# Altium project UltraZOhm_CarrierBoard.PrjPcb (part 4 of 8)

## Sheet Board2Board.SchDoc
size A4; Author: A. Geiger & E. Liegmann; CompanyName: Technische Hochschule Nürnberg Georg Simon Ohm; Organization: UltraZohm; Address1: Kesslerplatz 12; Address2: 90489 Nürnberg; Address3: GERMANY; SheetNumber: 2; SheetTotal: 36; Website: www.ultrazohm.com
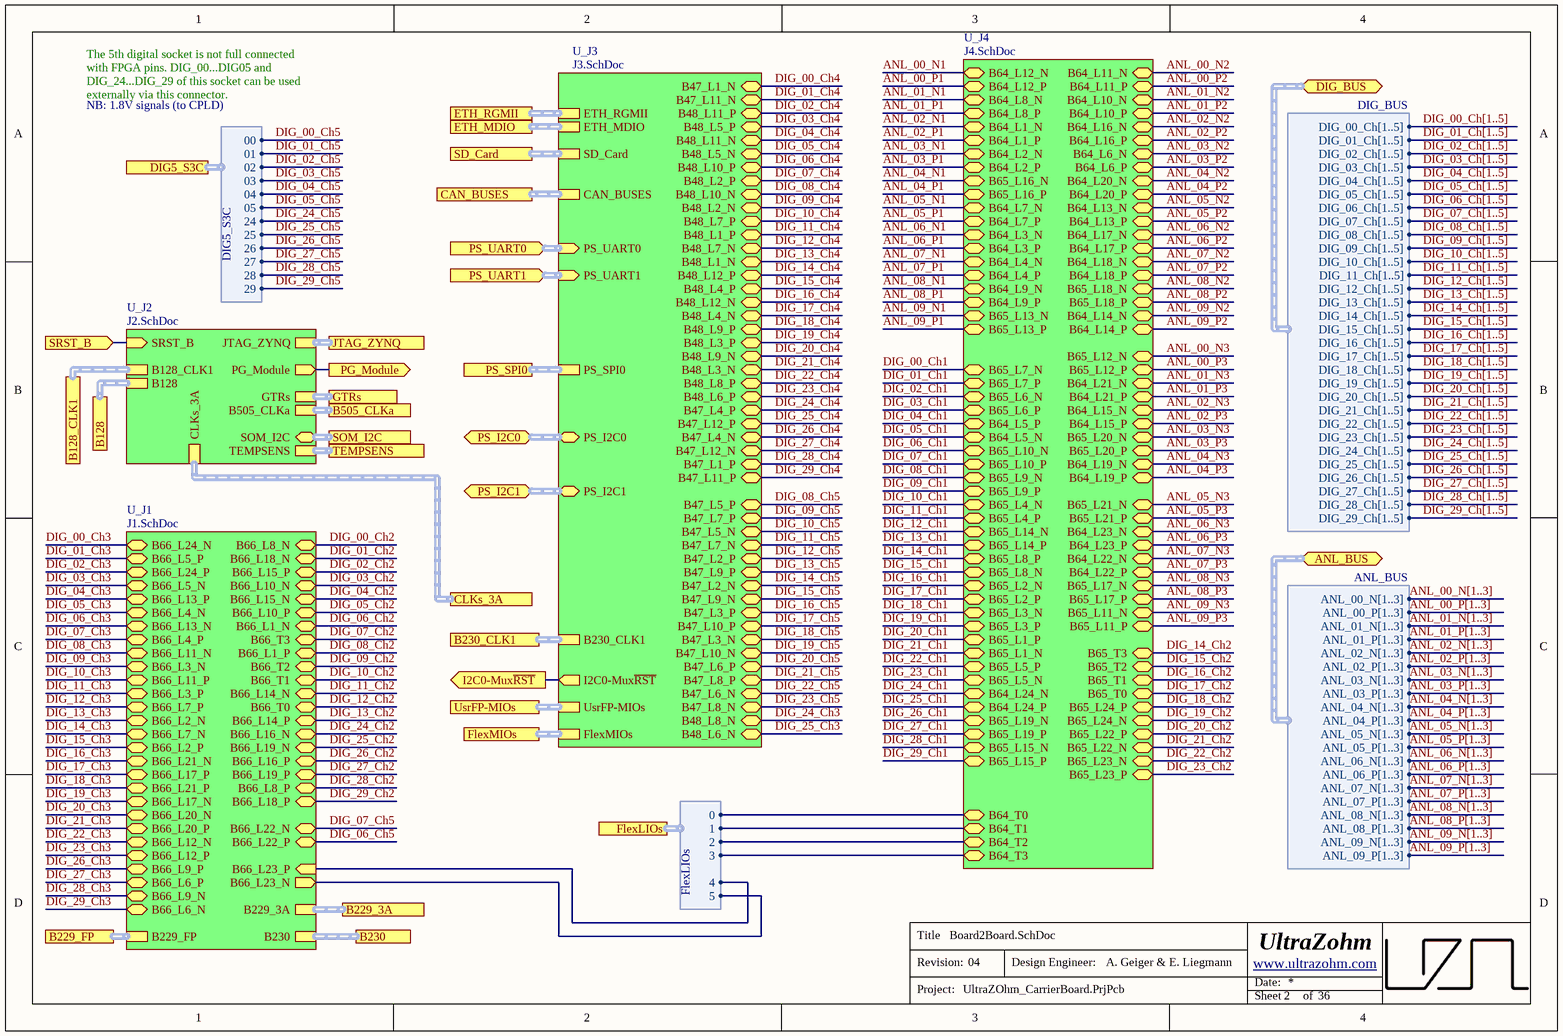
[diagram p11: Board2Board.SchDoc]

### Sub-sheets
U_J1 = J1.SchDoc: B66_L1_P (bidir), B66_L1_N (bidir), B66_L5_P (bidir), B66_L5_N (bidir), B66_L6_P (bidir), B66_L6_N (bidir), B66_L4_N (bidir), B66_L4_P (bidir), B66_L2_N (bidir), B66_L24_N (bidir), B66_L9_N (bidir), B66_L8_N (bidir), B66_L23_N (out), B66_L20_N (bidir), B66_L12_N (bidir), B66_L24_P (bidir), B66_L8_P (bidir), B66_L18_N (bidir), B66_L21_N (bidir), B66_L7_P (bidir), B66_L19_P (bidir), B66_L11_N (bidir), B66_L20_P (bidir), B66_L21_P (bidir), B66_L9_P (bidir), B66_L10_P (bidir), B66_L22_P (bidir), B66_L16_N (bidir), B66_L3_P (bidir), B66_L17_N (bidir), B66_L15_P (bidir), B66_L16_P (bidir), B66_L19_N (bidir), B66_L14_N (bidir), B66_L17_P (bidir), B66_L7_N (bidir), B66_L3_N (bidir), B66_L10_N (bidir), B66_L15_N (bidir), B66_L22_N (bidir), B66_L14_P (bidir), B66_L11_P (bidir), B66_L2_P (bidir), B66_L13_P (bidir), B66_L23_P (in), B66_L18_P (bidir), B66_L12_P (bidir), B66_L13_N (bidir), B66_T1 (bidir), B66_T2 (bidir), B66_T0 (bidir), B66_T3 (bidir), B229_3A (harness MGT3), B230 (harness MGT4), B229_FP (harness GTH)
U_J2 = J2.SchDoc: SRST_B (in), PG_Module (out), SOM_I2C (bidir, harness I2C), GTRs (harness GTRs), JTAG_ZYNQ (harness JTAG), TEMPSENS (harness T_DIODE), B505_CLKa (harness MGTCLK), CLKs_3A (harness CLKs_3A), B128 (harness MGT4), B128_CLK1 (harness MGTCLK)
U_J3 = J3.SchDoc: B48_L9_P (bidir), B47_L6_P (bidir), B48_L2_P (bidir), B48_L8_N (bidir), B48_L1_P (bidir), B47_L8_N (bidir), B47_L10_P (bidir), B47_L12_P (bidir), B47_L8_P (bidir), B47_L9_P (bidir), B48_L12_P (bidir), B48_L2_N (bidir), B47_L4_P (bidir), B47_L2_P (bidir), B47_L10_N (bidir), B48_L12_N (bidir), B47_L2_N (bidir), B47_L3_N (bidir), B48_L6_N (bidir), B48_L3_P (bidir), B47_L3_P (bidir), B47_L7_N (bidir), B48_L11_N (bidir), B48_L4_P (bidir), B47_L5_P (bidir), B47_L1_N (bidir), B47_L1_P (bidir), B47_L6_N (bidir), B48_L5_P (bidir), B48_L10_P (bidir), B47_L5_N (bidir), B48_L3_N (bidir), B47_L7_P (bidir), B48_L1_N (bidir), B48_L5_N (bidir), B47_L12_N (bidir), B48_L9_N (bidir), B48_L11_P (bidir), B47_L9_N (bidir), B48_L4_N (bidir), B47_L4_N (bidir), B48_L6_P (bidir), B47_L11_P (bidir), B48_L8_P (bidir), B48_L10_N (bidir), B47_L11_N (bidir), B48_L7_P (bidir), B48_L7_N (bidir), PS_UART0 (in, harness UART), PS_UART1 (in, harness UART), PS_I2C1 (bidir, harness I2C), PS_I2C0 (bidir, harness I2C), ETH_RGMII (harness ETH_RGMII), SD_Card (harness SD_Card), ETH_MDIO (harness ETH_MDIO), PS_SPI0 (harness SPI), CAN_BUSES (harness CAN_BUSES), UsrFP-MIOs (harness UsrFP-MIOs), FlexMIOs (harness FlexMIOs), I2C0-Mux~{RST} (out), B230_CLK1 (harness MGTCLK)
U_J4 = J4.SchDoc: B65_L1_N (bidir), B65_L1_P (bidir), B64_L9_N (bidir), B64_L5_P (bidir), B64_L9_P (bidir), B64_L4_P (bidir), B64_L7_N (bidir), B64_L2_N (bidir), B64_L4_N (bidir), B64_L12_N (bidir), B64_L1_P (bidir), B64_L12_P (bidir), B64_L10_N (bidir), B64_L8_N (bidir), B64_L6_P (bidir), B64_L7_P (bidir), B64_L5_N (bidir), B64_L3_P (bidir), B64_L6_N (bidir), B64_L3_N (bidir), B64_L1_N (bidir), B64_L2_P (bidir), B64_L11_N (bidir), B64_L10_P (bidir), B64_L8_P (bidir), B64_L11_P (bidir), B64_L21_P (bidir), B64_L19_P (bidir), B64_L16_N (bidir), B64_L13_P (bidir), B64_L14_P (bidir), B64_L17_N (bidir), B64_L18_N (bidir), B64_L16_P (bidir), B64_L20_P (bidir), B64_L24_P (bidir), B64_L15_P (bidir), B64_L13_N (bidir), B64_L14_N (bidir), B64_L23_P (bidir), B64_L24_N (bidir), B64_L15_N (bidir), B64_L19_N (bidir), B64_L17_P (bidir), B64_L22_P (bidir), B64_L20_N (bidir), B64_L22_N (bidir), B64_L23_N (bidir), B64_L18_P (bidir), B64_L21_N (bidir), B65_L5_P (bidir), B65_L9_P (bidir), B65_L10_P (bidir), B65_L8_P (bidir), B65_L10_N (bidir), B65_L2_N (bidir), B65_L11_P (bidir), B65_L6_N (bidir), B65_L11_N (bidir), B65_L4_P (bidir), B65_L8_N (bidir), B65_L5_N (bidir), B65_L7_N (bidir), B65_L7_P (bidir), B65_L12_P (bidir), B65_L3_P (bidir), B65_L12_N (bidir), B65_L3_N (bidir), B65_L4_N (bidir), B65_L2_P (bidir), B65_L6_P (bidir), B65_L9_N (bidir), B65_L16_P (bidir), B65_L23_N (bidir), B65_L13_N (bidir), B65_L13_P (bidir), B65_L16_N (bidir), B65_L24_P (bidir), B65_L21_P (bidir), B65_L15_N (bidir), B65_L17_N (bidir), B65_L18_P (bidir), B65_L20_N (bidir), B65_L19_P (bidir), B65_L21_N (bidir), B65_L15_P (bidir), B65_L22_N (bidir), B65_L23_P (bidir), B65_L17_P (bidir), B65_L22_P (bidir), B65_L24_N (bidir), B65_L19_N (bidir), B65_L18_N (bidir), B65_L20_P (bidir), B65_T1 (bidir), B65_T2 (bidir), B65_T3 (bidir), B65_T0 (bidir), B65_L14_N (bidir), B65_L14_P (bidir), B64_T0 (bidir), B64_T1 (bidir), B64_T2 (bidir), B64_T3 (bidir)

### Ports
ANL_BUS (bidir, harness ANL_BUS), B128 (harness MGT4), B128_CLK1 (harness MGTCLK), B229_3A (harness MGT3), B229_FP (harness GTH), B230 (harness MGT4), B230_CLK1 (harness MGTCLK), B505_CLKa (harness MGTCLK), CAN_BUSES (harness CAN_BUSES), CLKs_3A (harness CLKs_3A), DIG5_S3C (harness DIG5_S3C), DIG_BUS (bidir, harness DIG_BUS), ETH_MDIO (harness ETH_MDIO), ETH_RGMII (harness ETH_RGMII), FlexLIOs (harness FlexLIOs), FlexMIOs (harness FlexMIOs), GTRs (harness GTRs), I2C0-Mux~{RST} (out), JTAG_ZYNQ (harness JTAG), PG_Module (out), PS_I2C0 (bidir, harness I2C), PS_I2C1 (bidir, harness I2C), PS_SPI0 (harness SPI), PS_UART0 (in, harness UART), PS_UART1 (in, harness UART), SD_Card (harness SD_Card), SOM_I2C (harness I2C), SRST_B (in), TEMPSENS (harness T_DIODE), UsrFP-MIOs (harness UsrFP-MIOs)

### Harnesses
DIG_BUS: DIG_01_Ch[1..5], DIG_02_Ch[1..5], DIG_03_Ch[1..5], DIG_04_Ch[1..5], DIG_05_Ch[1..5], DIG_06_Ch[1..5], DIG_07_Ch[1..5], DIG_08_Ch[1..5], DIG_09_Ch[1..5], DIG_10_Ch[1..5], DIG_11_Ch[1..5], DIG_12_Ch[1..5], DIG_13_Ch[1..5], DIG_14_Ch[1..5], DIG_15_Ch[1..5], DIG_16_Ch[1..5], DIG_17_Ch[1..5], DIG_18_Ch[1..5], DIG_19_Ch[1..5], DIG_20_Ch[1..5], DIG_21_Ch[1..5], DIG_22_Ch[1..5], DIG_23_Ch[1..5], DIG_24_Ch[1..5], DIG_25_Ch[1..5], DIG_26_Ch[1..5], DIG_27_Ch[1..5], DIG_28_Ch[1..5], DIG_29_Ch[1..5], DIG_00_Ch[1..5]
ANL_BUS: ANL_00_N[1..3], ANL_00_P[1..3], ANL_01_N[1..3], ANL_01_P[1..3], ANL_02_N[1..3], ANL_02_P[1..3], ANL_03_N[1..3], ANL_03_P[1..3], ANL_04_N[1..3], ANL_04_P[1..3], ANL_05_N[1..3], ANL_05_P[1..3], ANL_06_N[1..3], ANL_06_P[1..3], ANL_07_N[1..3], ANL_07_P[1..3], ANL_08_N[1..3], ANL_08_P[1..3], ANL_09_N[1..3], ANL_09_P[1..3]
DIG5_S3C: 00, 01, 02, 03, 04, 05, 24, 25, 26, 27, 28, 29
FlexLIOs: 0, 1, 2, 3, 4, 5

### Nets
B66_L23_N: sheet U_J1/B66_L23_N, port FlexLIOs.5
B66_L23_P: sheet U_J1/B66_L23_P, port FlexLIOs.4
DIG_00_Ch5: port DIG5_S3C.00
DIG_01_Ch5: port DIG5_S3C.01
DIG_02_Ch5: port DIG5_S3C.02
DIG_03_Ch5: port DIG5_S3C.03
DIG_04_Ch5: port DIG5_S3C.04
DIG_05_Ch5: port DIG5_S3C.05
DIG_24_Ch5: port DIG5_S3C.24
DIG_25_Ch5: port DIG5_S3C.25
DIG_26_Ch5: port DIG5_S3C.26
DIG_27_Ch5: port DIG5_S3C.27
DIG_28_Ch5: port DIG5_S3C.28
DIG_29_Ch5: port DIG5_S3C.29
I2C0-Mux~{RST}: port I2C0-Mux~{RST}, sheet U_J3/I2C0-Mux~{RST}
PG_PL: port PG_Module, sheet U_J2/PG_Module
SRST_B: port SRST_B, sheet U_J2/SRST_B
(unnamed): sheet U_J4/B64_T0, port FlexLIOs.0
(unnamed): sheet U_J4/B64_T1, port FlexLIOs.1
(unnamed): sheet U_J4/B64_T2, port FlexLIOs.2
(unnamed): sheet U_J4/B64_T3, port FlexLIOs.3

### Buses and harness runs
bus ANL_00_N[1..3]
bus ANL_00_P[1..3]
bus ANL_01_N[1..3]
bus ANL_01_P[1..3]
bus ANL_02_N[1..3]
bus ANL_02_P[1..3]
bus ANL_03_N[1..3]
bus ANL_03_P[1..3]
bus ANL_04_N[1..3]
bus ANL_04_P[1..3]
bus ANL_05_N[1..3]
bus ANL_05_P[1..3]
bus ANL_06_N[1..3]
bus ANL_06_P[1..3]
bus ANL_07_N[1..3]
bus ANL_07_P[1..3]
bus ANL_08_N[1..3]
bus ANL_08_P[1..3]
bus ANL_09_N[1..3]
bus ANL_09_P[1..3]
bus DIG_00_Ch[1..5]
bus DIG_01_Ch[1..5]
bus DIG_02_Ch[1..5]
bus DIG_03_Ch[1..5]
bus DIG_04_Ch[1..5]
bus DIG_05_Ch[1..5]
bus DIG_06_Ch[1..5]
bus DIG_07_Ch[1..5]
bus DIG_08_Ch[1..5]
bus DIG_09_Ch[1..5]
bus DIG_10_Ch[1..5]
bus DIG_11_Ch[1..5]
bus DIG_12_Ch[1..5]
bus DIG_13_Ch[1..5]
bus DIG_14_Ch[1..5]
bus DIG_15_Ch[1..5]
bus DIG_16_Ch[1..5]
bus DIG_17_Ch[1..5]
bus DIG_18_Ch[1..5]
bus DIG_19_Ch[1..5]
bus DIG_20_Ch[1..5]
bus DIG_21_Ch[1..5]
bus DIG_22_Ch[1..5]
bus DIG_23_Ch[1..5]
bus DIG_24_Ch[1..5]
bus DIG_25_Ch[1..5]
bus DIG_26_Ch[1..5]
bus DIG_27_Ch[1..5]
bus DIG_28_Ch[1..5]
bus DIG_29_Ch[1..5]
harness port B128 = sheet U_J2/B128
harness port B128_CLK1 = sheet U_J2/B128_CLK1
harness port B229_3A = sheet U_J1/B229_3A
harness port B229_FP = sheet U_J1/B229_FP
harness port B230 = sheet U_J1/B230
harness port B230_CLK1 = sheet U_J3/B230_CLK1
harness port B505_CLKa = sheet U_J2/B505_CLKa
harness port CAN_BUSES = sheet U_J3/CAN_BUSES
harness port CLKs_3A = sheet U_J2/CLKs_3A
harness port ETH_MDIO = sheet U_J3/ETH_MDIO
harness port ETH_RGMII = sheet U_J3/ETH_RGMII
harness port FlexMIOs = sheet U_J3/FlexMIOs
harness port GTRs = sheet U_J2/GTRs
harness port JTAG_ZYNQ = sheet U_J2/JTAG_ZYNQ
harness port PS_I2C0 = sheet U_J3/PS_I2C0
harness port PS_I2C1 = sheet U_J3/PS_I2C1
harness port PS_SPI0 = sheet U_J3/PS_SPI0
harness port PS_UART0 = sheet U_J3/PS_UART0
harness port PS_UART1 = sheet U_J3/PS_UART1
harness port SD_Card = sheet U_J3/SD_Card
harness port SOM_I2C = sheet U_J2/SOM_I2C
harness port TEMPSENS = sheet U_J2/TEMPSENS
harness port UsrFP-MIOs = sheet U_J3/UsrFP-MIOs

### Notes on the sheet
- The 5th digital socket is not full connected with FPGA pins. DIG_00...DIG05 and DIG_24...DIG_29 of this socket can be used externally via this connector.
- NB: 1.8V signals (to CPLD)
- Title
- Revision:
- Design Engineer:
- Date:
- Project:
- Sheet
- of

## Sheet J1.SchDoc
size A4; Author: A. Geiger & E. Liegmann; CompanyName: Technische Hochschule Nürnberg Georg Simon Ohm; Organization: UltraZohm; Address1: Kesslerplatz 12; Address2: 90489 Nürnberg; Address3: GERMANY; SheetNumber: 3; SheetTotal: 36; Website: www.ultrazohm.com
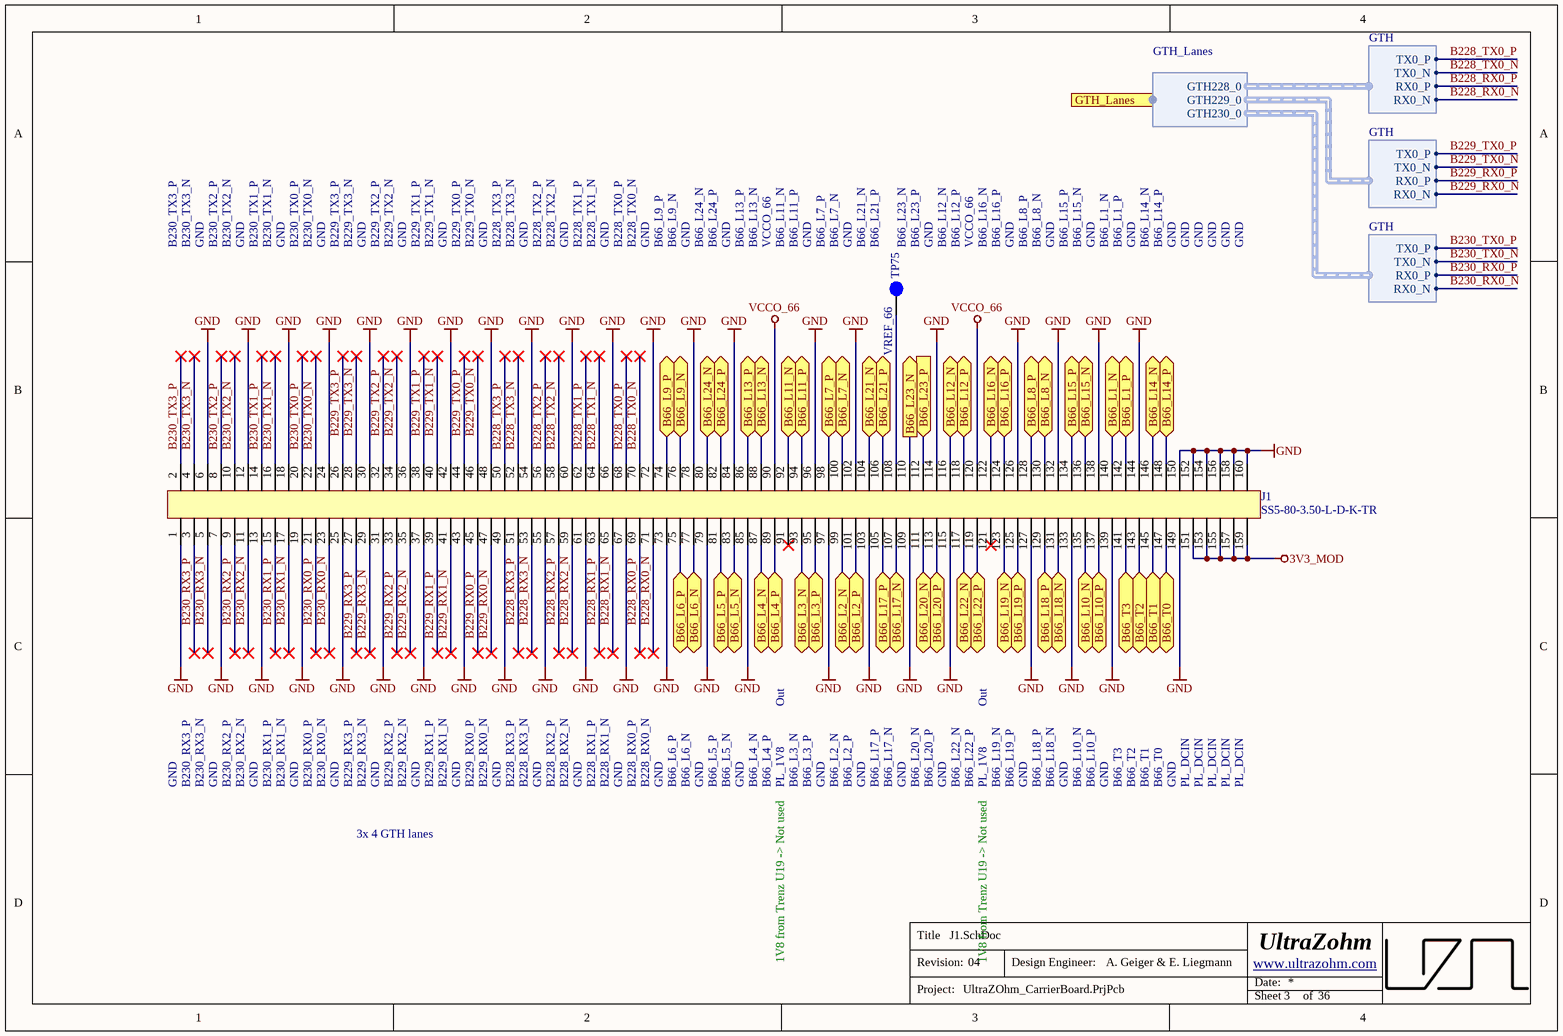
[diagram p12: J1.SchDoc]

### Parts
J1  SS5-80-3.50-L-D-K-TR  [SS5-80-3.50-L-D-K-TR]
TP75  Testpoint 1mm  [TP_1mm]  (value not drawn)  (no BOM)

### Ports
B66_L1_N (bidir), B66_L1_P (bidir), B66_L2_N (bidir), B66_L2_P (bidir), B66_L3_N (bidir), B66_L3_P (bidir), B66_L4_N (bidir), B66_L4_P (bidir), B66_L5_N (bidir), B66_L5_P (bidir), B66_L6_N (bidir), B66_L6_P (bidir), B66_L7_N (bidir), B66_L7_P (bidir), B66_L8_N (bidir), B66_L8_P (bidir), B66_L9_N (bidir), B66_L9_P (bidir), B66_L10_N (bidir), B66_L10_P (bidir), B66_L11_N (bidir), B66_L11_P (bidir), B66_L12_N (bidir), B66_L12_P (bidir), B66_L13_N (bidir), B66_L13_P (bidir), B66_L14_N (bidir), B66_L14_P (bidir), B66_L15_N (bidir), B66_L15_P (bidir), B66_L16_N (bidir), B66_L16_P (bidir), B66_L17_N (bidir), B66_L17_P (bidir), B66_L18_N (bidir), B66_L18_P (bidir), B66_L19_N (bidir), B66_L19_P (bidir), B66_L20_N (bidir), B66_L20_P (bidir), B66_L21_N (bidir), B66_L21_P (bidir), B66_L22_N (bidir), B66_L22_P (bidir), B66_L23_N (out), B66_L23_P (in), B66_L24_N (bidir), B66_L24_P (bidir), B66_T0 (bidir), B66_T1 (bidir), B66_T2 (bidir), B66_T3 (bidir), GTH_Lanes (harness GTH_Lanes)

### Harnesses
GTH: TX0_P, TX0_N, RX0_P, RX0_N
GTH_Lanes: GTH228_0, GTH230_0, GTH229_0

### Nets
3V3_MOD: J1.151 J1.153 J1.155 J1.157 J1.159
GND: J1.1 J1.6 J1.7 J1.12 J1.13 J1.18 J1.19 J1.24 J1.25 J1.30 J1.31 J1.36 J1.37 J1.42 J1.43 J1.48 J1.49 J1.54 J1.55 J1.60 J1.61 J1.66 J1.67 J1.72 J1.73 J1.78 J1.79 J1.84 J1.85 J1.96 J1.97 J1.102 J1.103 J1.109 J1.114 J1.115 J1.126 J1.127 J1.132 J1.133 J1.138 J1.139 J1.144 J1.149 J1.150 J1.152 J1.154 J1.156 J1.158 J1.160
VCCO_66: J1.90 J1.120
B66_L23_N: J1.110 ; port B66_L23_N
B66_L23_P: J1.112 ; port B66_L23_P
B228_RX0_N: J1.71 ; harness GTH.RX0_N
B228_RX0_P: J1.69 ; harness GTH.RX0_P
B228_RX1_N: J1.65
B228_RX1_P: J1.63
B228_RX2_N: J1.59
B228_RX2_P: J1.57
B228_RX3_N: J1.53
B228_RX3_P: J1.51
B228_TX0_N: J1.70 ; harness GTH.TX0_N
B228_TX0_P: J1.68 ; harness GTH.TX0_P
B228_TX1_N: J1.64
B228_TX1_P: J1.62
B228_TX2_N: J1.58
B228_TX2_P: J1.56
B228_TX3_N: J1.52
B228_TX3_P: J1.50
B229_RX0_N: J1.47 ; harness GTH.RX0_N
B229_RX0_P: J1.45 ; harness GTH.RX0_P
B229_RX1_N: J1.41
B229_RX1_P: J1.39
B229_RX2_N: J1.35
B229_RX2_P: J1.33
B229_RX3_N: J1.29
B229_RX3_P: J1.27
B229_TX0_N: J1.46 ; harness GTH.TX0_N
B229_TX0_P: J1.44 ; harness GTH.TX0_P
B229_TX1_N: J1.40
B229_TX1_P: J1.38
B229_TX2_N: J1.34
B229_TX2_P: J1.32
B229_TX3_N: J1.28
B229_TX3_P: J1.26
B230_RX0_N: J1.23 ; harness GTH.RX0_N
B230_RX0_P: J1.21 ; harness GTH.RX0_P
B230_RX1_N: J1.17
B230_RX1_P: J1.15
B230_RX2_N: J1.11
B230_RX2_P: J1.9
B230_RX3_N: J1.5
B230_RX3_P: J1.3
B230_TX0_N: J1.22 ; harness GTH.TX0_N
B230_TX0_P: J1.20 ; harness GTH.TX0_P
B230_TX1_N: J1.16
B230_TX1_P: J1.14
B230_TX2_N: J1.10
B230_TX2_P: J1.8
B230_TX3_N: J1.4
B230_TX3_P: J1.2
DIG_00_Ch2: J1.130 ; port B66_L8_N
DIG_00_Ch3: J1.80 ; port B66_L24_N
DIG_01_Ch2: J1.131 ; port B66_L18_N
DIG_01_Ch3: J1.81 ; port B66_L5_P
DIG_02_Ch2: J1.134 ; port B66_L15_P
DIG_02_Ch3: J1.82 ; port B66_L24_P
DIG_03_Ch2: J1.135 ; port B66_L10_N
DIG_03_Ch3: J1.83 ; port B66_L5_N
DIG_04_Ch2: J1.136 ; port B66_L15_N
DIG_04_Ch3: J1.86 ; port B66_L13_P
DIG_05_Ch2: J1.137 ; port B66_L10_P
DIG_05_Ch3: J1.87 ; port B66_L4_N
DIG_06_Ch2: J1.140 ; port B66_L1_N
DIG_06_Ch3: J1.88 ; port B66_L13_N
DIG_06_Ch5: J1.119 ; port B66_L22_P
DIG_07_Ch2: J1.141 ; port B66_T3
DIG_07_Ch3: J1.89 ; port B66_L4_P
DIG_07_Ch5: J1.117 ; port B66_L22_N
DIG_08_Ch2: J1.142 ; port B66_L1_P
DIG_08_Ch3: J1.92 ; port B66_L11_N
DIG_09_Ch2: J1.143 ; port B66_T2
DIG_09_Ch3: J1.93 ; port B66_L3_N
DIG_10_Ch2: J1.145 ; port B66_T1
DIG_10_Ch3: J1.94 ; port B66_L11_P
DIG_11_Ch2: J1.146 ; port B66_L14_N
DIG_11_Ch3: J1.95 ; port B66_L3_P
DIG_12_Ch2: J1.147 ; port B66_T0
DIG_12_Ch3: J1.98 ; port B66_L7_P
DIG_13_Ch2: J1.148 ; port B66_L14_P
DIG_13_Ch3: J1.99 ; port B66_L2_N
DIG_14_Ch3: J1.100 ; port B66_L7_N
DIG_15_Ch3: J1.101 ; port B66_L2_P
DIG_16_Ch3: J1.104 ; port B66_L21_N
DIG_17_Ch3: J1.105 ; port B66_L17_P
DIG_18_Ch3: J1.106 ; port B66_L21_P
DIG_19_Ch3: J1.107 ; port B66_L17_N
DIG_20_Ch3: J1.111 ; port B66_L20_N
DIG_21_Ch3: J1.113 ; port B66_L20_P
DIG_22_Ch3: J1.116 ; port B66_L12_N
DIG_23_Ch3: J1.118 ; port B66_L12_P
DIG_24_Ch2: J1.122 ; port B66_L16_N
DIG_25_Ch2: J1.123 ; port B66_L19_N
DIG_26_Ch2: J1.124 ; port B66_L16_P
DIG_26_Ch3: J1.74 ; port B66_L9_P
DIG_27_Ch2: J1.125 ; port B66_L19_P
DIG_27_Ch3: J1.75 ; port B66_L6_P
DIG_28_Ch2: J1.128 ; port B66_L8_P
DIG_28_Ch3: J1.76 ; port B66_L9_N
DIG_29_Ch2: J1.129 ; port B66_L18_P
DIG_29_Ch3: J1.77 ; port B66_L6_N
NetJ1_108: J1.108 TP75.1

Not connected (* = marked no-connect by the designer): J1 91* 121*

### Notes on the sheet
- B230_TX3_P
- B230_TX3_N
- GND
- B230_TX2_P
- B230_TX2_N
- B230_TX1_P
- B230_TX1_N
- B230_TX0_P
- B230_TX0_N
- B229_TX3_P
- B229_TX3_N
- B229_TX2_P
- B229_TX2_N
- B229_TX1_P
- B229_TX1_N
- B229_TX0_P
- B229_TX0_N
- B228_TX3_P
- B228_TX3_N
- B228_TX2_P
- B228_TX2_N
- B228_TX1_P
- B228_TX1_N
- B228_TX0_P
- B228_TX0_N
- B66_L9_P
- B66_L9_N
- B66_L24_N
- B66_L24_P
- B66_L13_P
- B66_L13_N
- VCCO_66
- B66_L11_N
- B66_L11_P
- B66_L7_P
- B66_L7_N
- (near TP75) B66_L21_N
- (near TP75) B66_L21_P
- (near TP75) B66_L23_N
- (near TP75) B66_L23_P
- (near TP75) GND
- B66_L12_N
- B66_L12_P
- B66_L16_N
- B66_L16_P
- B66_L8_P
- B66_L8_N
- B66_L15_P
- B66_L15_N
- B66_L1_N
- B66_L1_P
- B66_L14_N
- B66_L14_P
- (near TP75) VREF_66
- Out
- B230_RX3_P
- B230_RX3_N
- B230_RX2_P
- B230_RX2_N
- B230_RX1_P
- B230_RX1_N
- B230_RX0_P
- B230_RX0_N
- B229_RX3_P
- B229_RX3_N
- B229_RX2_P
- B229_RX2_N
- B229_RX1_P
- B229_RX1_N
- B229_RX0_P
- B229_RX0_N
- B228_RX3_P
- B228_RX3_N
- B228_RX2_P
- B228_RX2_N
- B228_RX1_P
- B228_RX1_N
- B228_RX0_P
- B228_RX0_N
- B66_L6_P
- B66_L6_N
- B66_L5_P
- B66_L5_N
- B66_L4_N
- B66_L4_P
- PL_1V8
- B66_L3_N
- B66_L3_P
- B66_L2_N
- B66_L2_P
- B66_L17_P
- B66_L17_N
- B66_L20_N
- B66_L20_P
- B66_L22_N
- B66_L22_P
- B66_L19_N
- B66_L19_P
- B66_L18_P
- B66_L18_N
- B66_L10_N
- B66_L10_P
- B66_T3
- B66_T2
- B66_T1
- B66_T0
- PL_DCIN
- 3x 4 GTH lanes
- 1V8 from Trenz U19 -> Not used
- Title
- Revision:
- Design Engineer:
- Date:
- Project:
- Sheet
- of

### Library data of the parts
J1 = SS5-80-3.50-L-D-K-TR: 0.5 mm Ultra Fine Pitch Socket REF192552-01, 160 Pins; Manufacturer: SAMTEC; Created from: MGremer; Number of positions: 80; Manufacturer Part Number: SS5-80-3.50-L-D-K-TR; PartID: 27; Created On: 01/12/2020 18:14:32; ComponentLink1Description: Homepage; ComponentLink1URL: https://www.samtec.com/de/products/ss5-80-3.50-l-d-k-tr; Component Type: Samtec Connector; Device Package: Connector; Last Updated: 11/07/2024 09:43:54; Mounting Type: SMD; Supplier 1: SAMTEC; Supplier Part Number 1: SS5-80-3.50-L-D-K-TR; Type: Connector; Live Cycle Status: 1; Number of rows: 2; Stock number: not stored; LCSC Part Number: C5292077
TP75 = 25063: AN: 25063; Mixed: SMT